# EAGLE design shinobi_1v8-5v_3V3_jack (EAGLE 8.5.1)
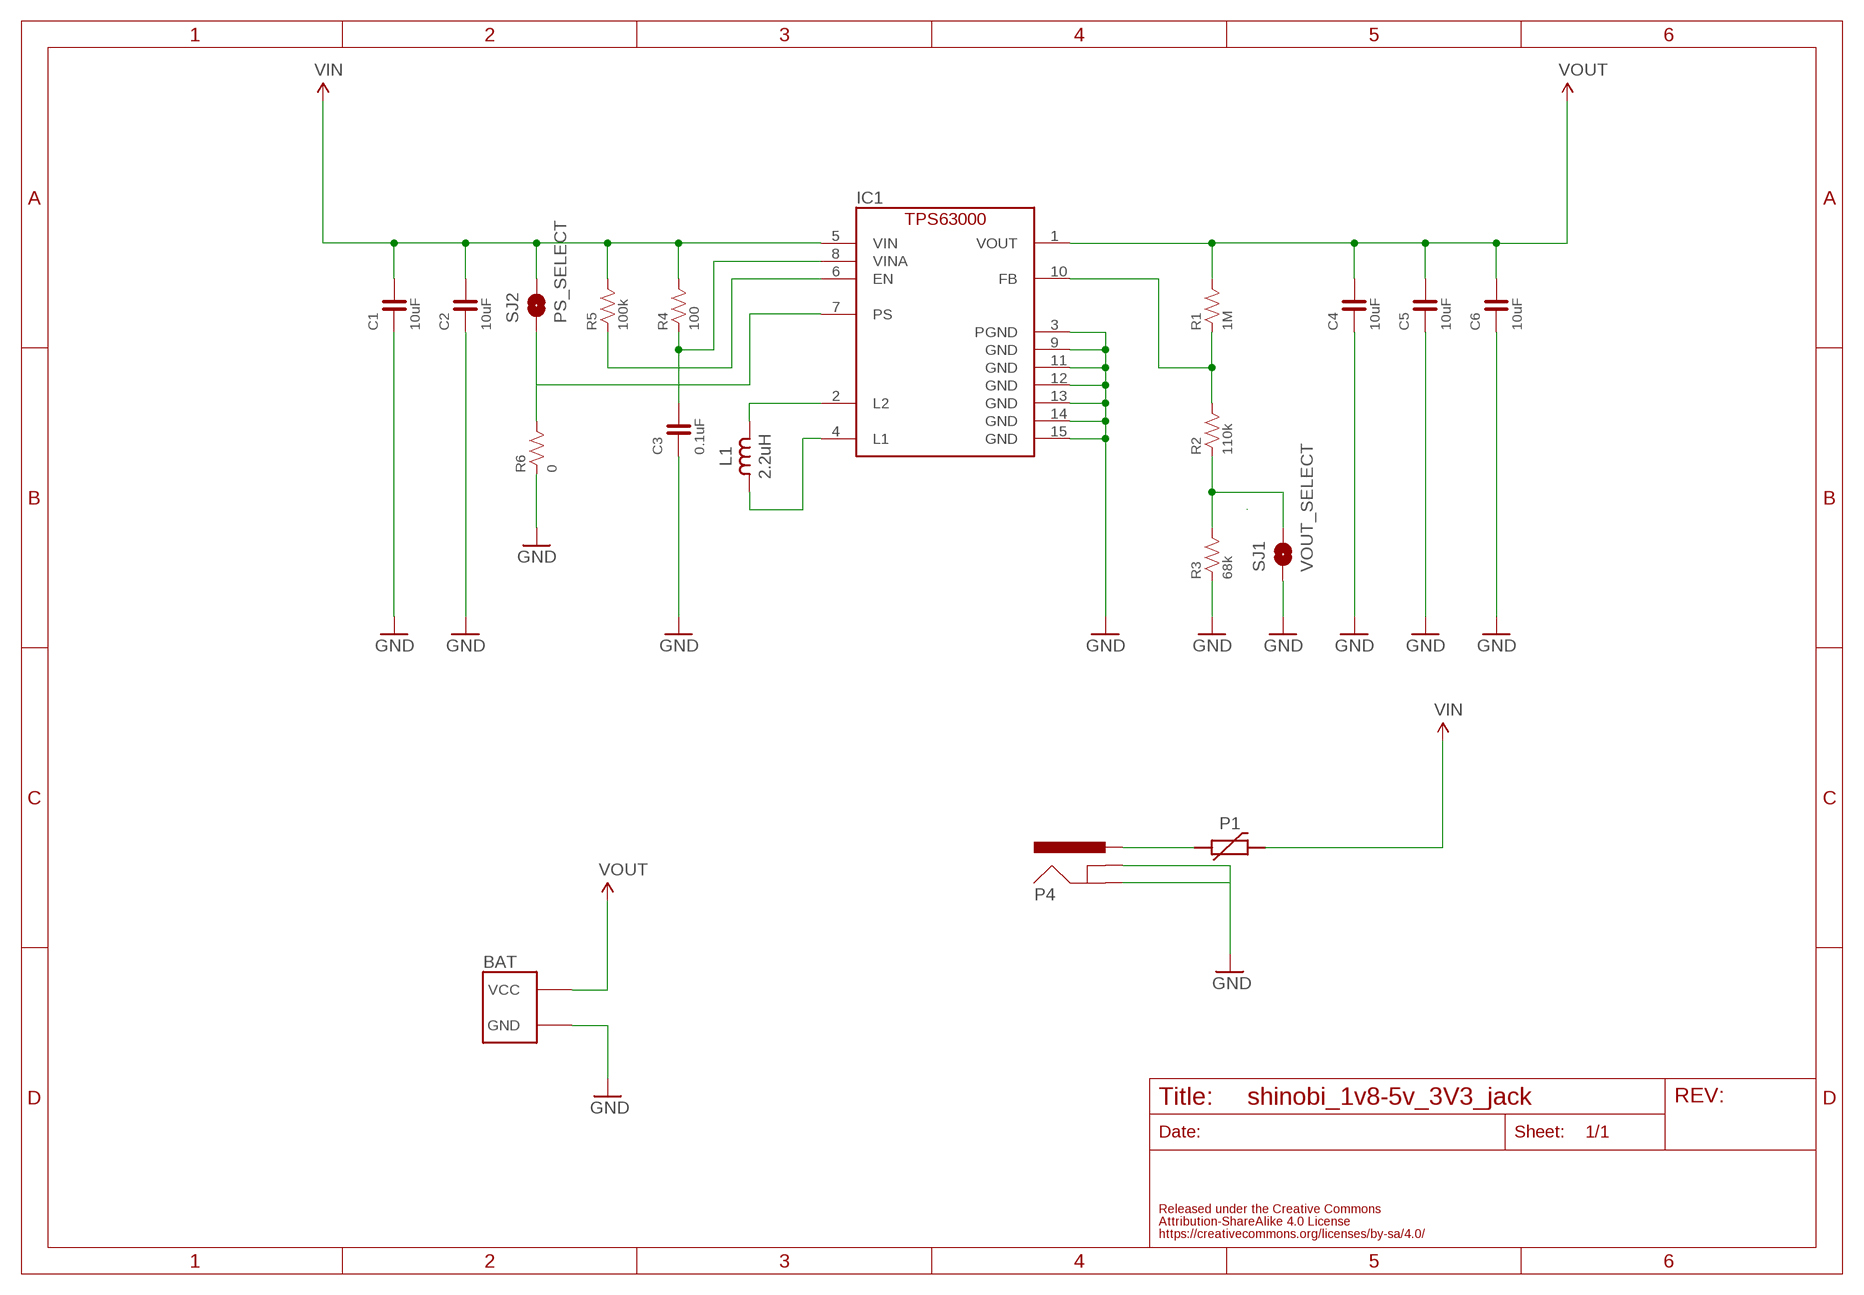
[diagram p0: schematic, sheet 1]

## Parts
BAT  FABO_BRICK_2PIN_SIDE  [FABO_BRICK_2PIN_S02B−PASK-2_SILK]
C1  10uF  CAPACITOR-0603_NARROW  [0603-NARROW]
C2  10uF  CAPACITOR-0603_NARROW  [0603-NARROW]
C3  0.1uF  CAPACITOR-0603_NARROW  [0603-NARROW]
C4  10uF  CAPACITOR-0603_NARROW  [0603-NARROW]
C5  10uF  CAPACITOR-0603_NARROW  [0603-NARROW]
C6  10uF  CAPACITOR-0603_NARROW  [0603-NARROW]
IC1  TPS63000DRC  [VSON-10]
L1  2.2uH  INDUCTOR-LQH3NPN  [LQH3NPN]
P1  POLYSWITCH1210  [1210]
P4  DC-JACKMA04339A0  [M04339A0]
R1  1M  RESISTOR-0603-NARROW  [0603-NARROW]
R2  110k  RESISTOR-0603-NARROW  [0603-NARROW]
R3  68k  RESISTOR-0603-NARROW  [0603-NARROW]
R4  100  RESISTOR-0603-NARROW  [0603-NARROW]
R5  100k  RESISTOR-0603-NARROW  [0603-NARROW]
R6  0  RESISTOR-0603-NARROW  [0603-NARROW]
SJ1  VOUT_SELECT  SMD-JUMPER-2-SHORT  [SMD-JUMPER-2-SHORT]
SJ2  PS_SELECT  SMD-JUMPER-2-SHORT  [SMD-JUMPER-2-SHORT]

## Nets
EN: IC1.6(EN) R5.1
FB: IC1.10(FB) R1.1 R2.2
GND: BAT.GND C1.1 C2.1 C3.1 C4.1 C5.1 C6.1 IC1.3(PGND) IC1.9(GND) IC1.11(GND) IC1.12(GND) IC1.13(GND) IC1.14(GND) IC1.15(GND) P4.GND@2(GND) P4.GND@3(GNDBREAK) R3.1 R6.1 SJ1.2
L1: IC1.4(L1) L1.1
L2: IC1.2(L2) L1.2
N$2: R2.1 R3.2 SJ1.1
N$3: P1.P$1 P4.VCC(PWR)
PS: IC1.7(PS) R6.2 SJ2.2
VIN: C1.2 C2.2 IC1.5(VIN) P1.P$2 R4.2 R5.2 SJ2.1
VINA: C3.2 IC1.8(VINA) R4.1
VOUT: BAT.VCC C4.2 C5.2 C6.2 IC1.1(VOUT) R1.2

## Library data of the parts
BAT = FaBo-Template:FABO_BRICK_2PIN
C1-C6 = FaBo-Capacitor:CAPACITOR: CAPACITOR
IC1 = FaBo-Supply:TPS63000
L1 = FaBo-Parts:INDUCTOR
P1 = FaBo-Supply:POLYSWITCH
P4 = FaBo-Supply:DC-JACK
R1-R6 = FaBo-Resistors:RESISTOR: RESISTOR
SJ1 SJ2 = FaBo-Supply:SMD-JUMPER-2

## Board
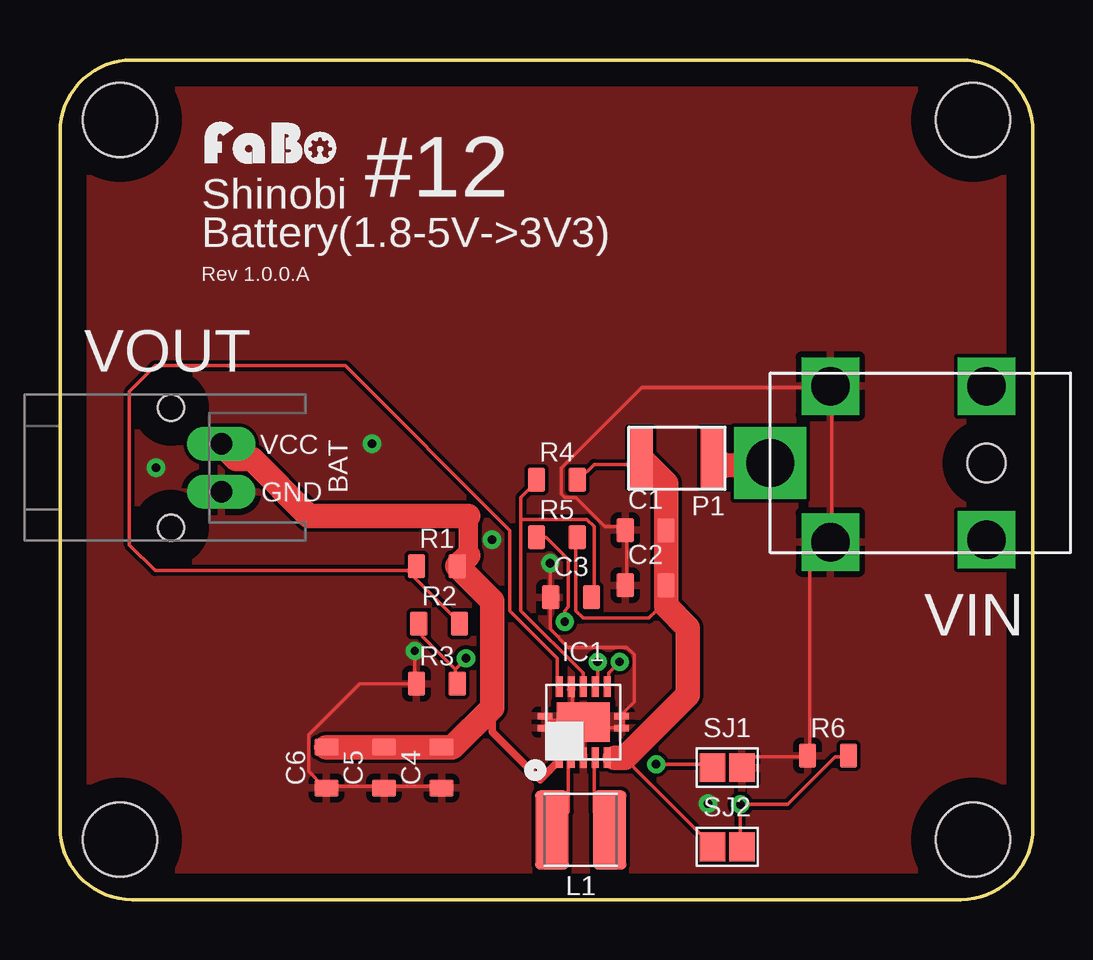
[diagram p1: board, top side]
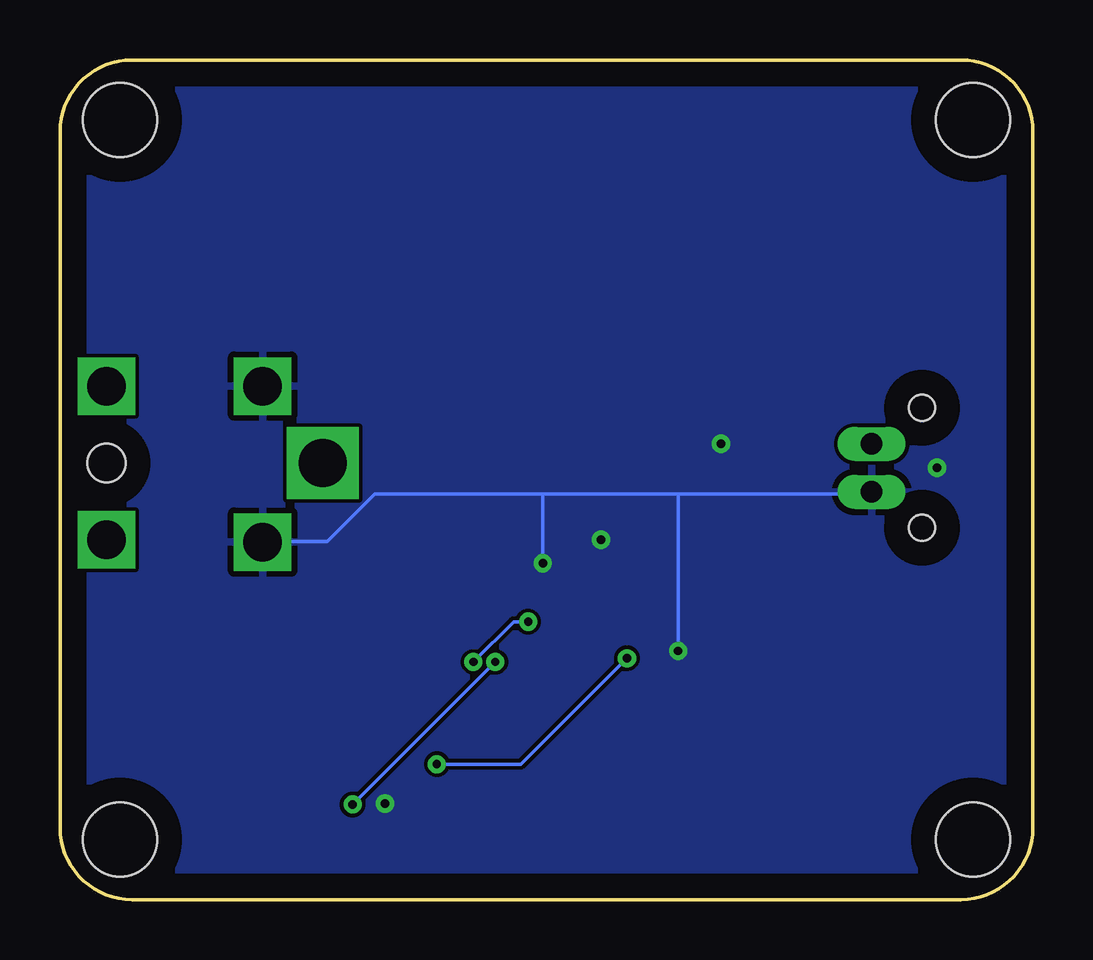
[diagram p2: board, bottom side, seen from below]

Size 40.54 x 35 mm. Coordinates in mm from the lower left corner, seen from the top.
Copper layers (1*16): Top 0.035mm / dielectric 1.5mm / Bottom 0.035mm
Design rules "default": minimum track width 6mil, minimum drill 0.35mm, track to track 6mil, track to pad 6mil, pad to pad 6mil, via to via 6mil, smd to smd 6mil, copper to edge 40mil, drill to drill 6mil, minimum pad ring 10mil, minimum via ring 8mil, stop-mask expansion 4mil, vias tented up to drill 0mil, thermal gap 10mil

### Footprints (pad centres in the part's own frame; a part is rotated, then mirrored left to right if it is on the bottom)
FABO_BRICK_2PIN_S02B−PASK-2_SILK = drill 0.9 pad 1.422 long: GND -1,-0.102; VCC 1,-0.102 | hole 1.1: 2.5,1.998; -2.5,1.998
0603-NARROW = smd 0.71 x 1: 1 -0.85,0; 2 0.85,0
VSON-10 = smd 0.3 x 0.85: 1 -1,-1.475; 2 -0.5,-1.475; 3 0,-1.475; 4 0.5,-1.475; 5 1,-1.475; 6 1,1.475; 7 0.5,1.475; 8 0,1.475; 9 -0.5,1.475; 10 -1,1.475 | smd 2.2 x 1.65: 11 0,0 | smd 0.6 x 0.28: 12 1.6,-0.25; 13 1.6,0.25; 14 -1.6,0.25; 15 -1.6,-0.25
LQH3NPN = smd 1.4 x 3.3: 1 -1.2,0; 2 1.2,0
1210 = smd 1 x 2.5: P$1 -1.5,0; P$2 1.5,0
M04339A0 = drill 1.6 square: GND@2 -3.2,-6.5; GND@3 3.3,-6.5; P$1 3.2,0; P$2 -3.2,0 | drill 2 square: VCC 0,-9 | hole 1.6: 0,0
SMD-JUMPER-2-SHORT = smd 1.067 x 1.2: 1 -0.61,0; 2 0.61,0
FABO-SHINOBI = hole 3.1: 2.5,32.5; 38.04,32.5; 38.04,2.5; 2.5,2.5

### Placement (x,y rotation side)
BAT  6.62,18 90 top
C1  24.4,15.4 0 top
C2  24.4,13.1 0 top
C3  21.3,12.6 0 top
C4  15.9,5.5 90 top
C5  13.5,5.5 90 top
C6  11.1,5.5 90 top
IC1  21.8,7.4 0 top
L1  21.7,2.9 180 top
P1  25.7,18.4 180 top
P4  38.6,18.2 270 top
R1  15.7,13.9 0 top
R2  15.8,11.5 0 top
R3  15.7,9 0 top
R4  20.7,17.5 0 top
R5  20.7,15.1 0 top
R6  32,6 0 top
SJ1  27.8,5.5 0 top
SJ2  27.8,2.2 0 top
U$2  [LOGO_FABO_S]  8.83,30.52 0 top
U$3  [FABO-SHINOBI]  0,0 0 top

### Tracks (layer width: path | path; a pad name or v marks a point on that pad's centre or on a via)
EN  (via drill 0.35)
  Top 0.152: v23.32,9.91 22.86,9.45 22.86,8.99 IC1.6 | v21.03,11.58 21.03,12.04 21.18,12.19 21.18,14.17 20.27,15.09 19.96,15.09 R5.1
  Bottom 0.152: v23.32,9.91 21.64,11.58 v21.03,11.58
FB
  Top 0.152: 14.48,13.72 14.63,13.72 14.78,13.87 R1.1 | 14.48,13.72 3.96,13.72 2.9,14.78 2.9,21.18 3.96,22.25 11.89,22.25 18.75,15.39 18.75,12.04 20.73,10.06 20.73,8.99 IC1.10 | 14.48,13.72 16.61,11.58 R2.2
GND  (via drill 0.35)
  Top 0.152: C2.1 23.62,13.11 23.62,15.39 C1.1 23.47,15.54 22.71,15.54 21.49,16.76 21.03,16.76 20.88,16.92 20.88,17.98 24.23,21.34 32,21.34 P4.GND@2 32.16,21.34 32.16,14.94 P4.GND@3 32,14.78 31.24,14.02 31.24,6.1 R6.1 31.09,5.94 28.8,5.94 28.5,5.64 SJ1.2 | 20.27,7.47 20.27,7.62 IC1.14 | 20.27,7.47 20.27,7.16 IC1.15 | 21.34,7.47 21.79,7.47 IC1.11 | 21.34,7.47 20.27,7.47 | IC1.11 21.95,7.32 22.1,7.16 23.32,7.16 IC1.12 23.47,7.16 23.47,7.62 IC1.13 23.47,7.77 23.93,8.23 23.93,10.21 23.62,10.52 21.18,10.52 20.42,11.28 20.42,12.5 C3.1 20.42,12.65 v20.42,14.02 | 21.34,7.47 21.34,8.84 IC1.9 | 21.34,7.47 IC1.11 | IC1.3 21.79,5.94 21.79,7.32 IC1.11 | C4.1 15.85,4.72 13.56,4.72 C5.1 13.41,4.72 11.12,4.72 C6.1 10.97,4.72 10.36,5.33 10.36,6.86 12.5,8.99 14.78,8.99 R3.1 14.78,9.14 v14.78,10.36
  Bottom 0.152: 20.42,16.92 27.43,16.92 29.41,14.94 32,14.94 P4.GND@3 | 20.42,16.92 14.78,16.92 | 14.78,16.92 6.86,16.92 BAT.GND | 14.78,16.92 v14.78,10.36 | 20.42,16.92 v20.42,14.02
  other vias: 13,19 4,18 27,4 18,15
  pour Bottom: 0,0 41,0 41,35 0,35
  pour Top: 0,0 41,0 41,35 0,35
L1
  Top 0.152: IC1.4 22.25,5.79 22.25,3.66 22.86,3.05 L1.1
L2
  Top 0.152: IC1.2 21.18,5.79 21.18,3.66 20.57,3.05 L1.2
N$2  (via drill 0.35)
  Top 0.152: 16.46,9.6 15.09,10.97 15.09,11.43 R2.1 | 16.46,9.6 16.46,9.14 R3.2 | v24.84,5.64 27.13,5.64 SJ1.1 | 16.46,9.6 v16.92,10.06
  Bottom 0.152: v24.84,5.64 21.34,5.64 v16.92,10.06
N$3
  Top 1.016: P4.VCC 27.7,18.1 P1.P$1
PS  (via drill 0.35)
  Top 0.152: v22.4,9.91 22.4,8.99 IC1.7 | SJ2.2 28.35,2.29 v28.35,3.96 30.33,3.96 32.31,5.94 32.77,5.94 R6.2
  Bottom 0.152: v28.35,3.96 v22.4,9.91
VIN
  Top 0.152: IC1.5 22.86,5.94 23.11,5.92 | P1.P$2 23.77,18.14 22.25,18.14 21.64,17.53 R4.2 | R5.2 21.49,15.09 21.49,12.04 21.79,11.73 24.54,11.73 24.84,12.04 25.25,12.25 | SJ2.1 27.13,2.29 23.77,5.64 23.54,5.92
  Top 1.016: P1.P$2 25.25,17.35 C1.2 C2.2 25.25,12.25 26.16,11.33 26.16,8.54 23.54,5.92 23.11,5.92
VINA
  Top 0.152: 19.2,15.85 19.2,16.76 19.81,17.37 R4.1 | 19.2,15.85 19.2,12.04 21.79,9.45 21.79,8.99 IC1.8 | 19.2,15.85 21.95,15.85 22.25,15.54 22.25,12.65 C3.2
VOUT
  Top 0.305: IC1.1 20.8,5.8 20,5 18,7 18,8
  Top 0.813: 17,16 17,14.35
  Top 1.016: BAT.VCC 7.35,18.37 8,18.37 10.37,16 17,16 | 17,14.35 R1.2 18,12.45 18,8 16.35,6.35 C4.2 C5.2 C6.2

### Text on the board
tPlace: Shinobi | #12 | Battery(1.8-5V->3V3) | Rev 1.0.0.A | VOUT | VIN